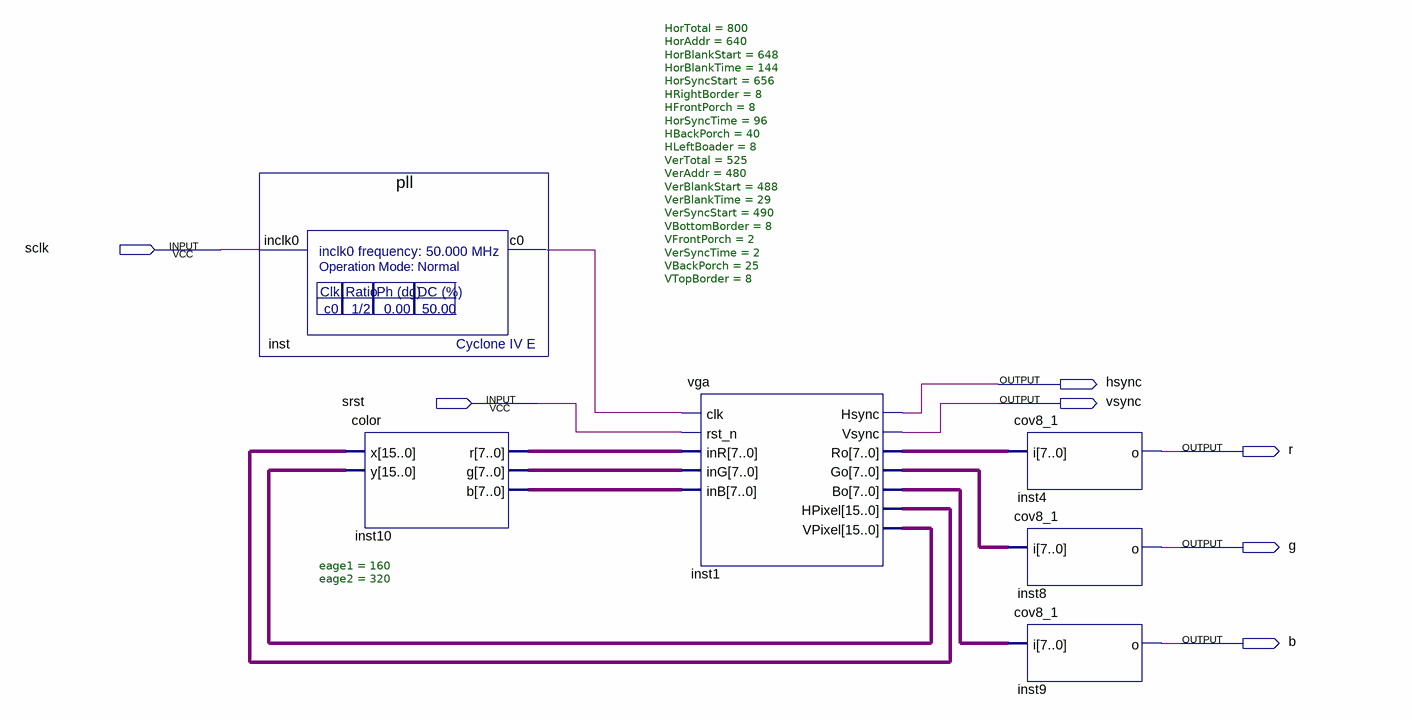
[diagram p0: schematic sheet]
// Quartus schematic temp.bdf as structural Verilog: 6 symbols, 7 pins
module temp (
  input  sclk,
  input  srst,
  output hsync,
  output vsync,
  output r,
  output g,
  output b
);

  wire inst_c0;
  wire [7:0] inst1_bo, inst1_go, inst1_ro, inst10_b, inst10_g, inst10_r;
  wire [15:0] inst1_hpixel, inst1_vpixel;

  pll inst (.inclk0(sclk), .c0(inst_c0));
  color #(.eage1(160), .eage2(320)) inst10 (
    .x(inst1_hpixel), .y(inst1_vpixel), .r(inst10_r), .g(inst10_g), .b(inst10_b));
  vga #(.HorTotal(800), .HorAddr(640), .HorBlankStart(648), .HorBlankTime(144), .HorSyncStart(656), .HRightBorder(8), .HFrontPorch(8), .HorSyncTime(96), .HBackPorch(40), .HLeftBoader(8), .VerTotal(525), .VerAddr(480), .VerBlankStart(488), .VerBlankTime(29), .VerSyncStart(490), .VBottomBorder(8), .VFrontPorch(2), .VerSyncTime(2), .VBackPorch(25), .VTopBorder(8)) inst1 (
    .clk(inst_c0), .rst_n(srst), .inR(inst10_r), .inG(inst10_g), .inB(inst10_b), .Hsync(hsync),
    .Vsync(vsync), .Ro(inst1_ro), .Go(inst1_go), .Bo(inst1_bo), .HPixel(inst1_hpixel), .VPixel(inst1_vpixel));
  cov8_1 inst4 (.i(inst1_ro), .o(r));
  cov8_1 inst8 (.i(inst1_go), .o(g));
  cov8_1 inst9 (.i(inst1_bo), .o(b));
endmodule
